# Altium project X_TRACK V3.1.PrjPcb
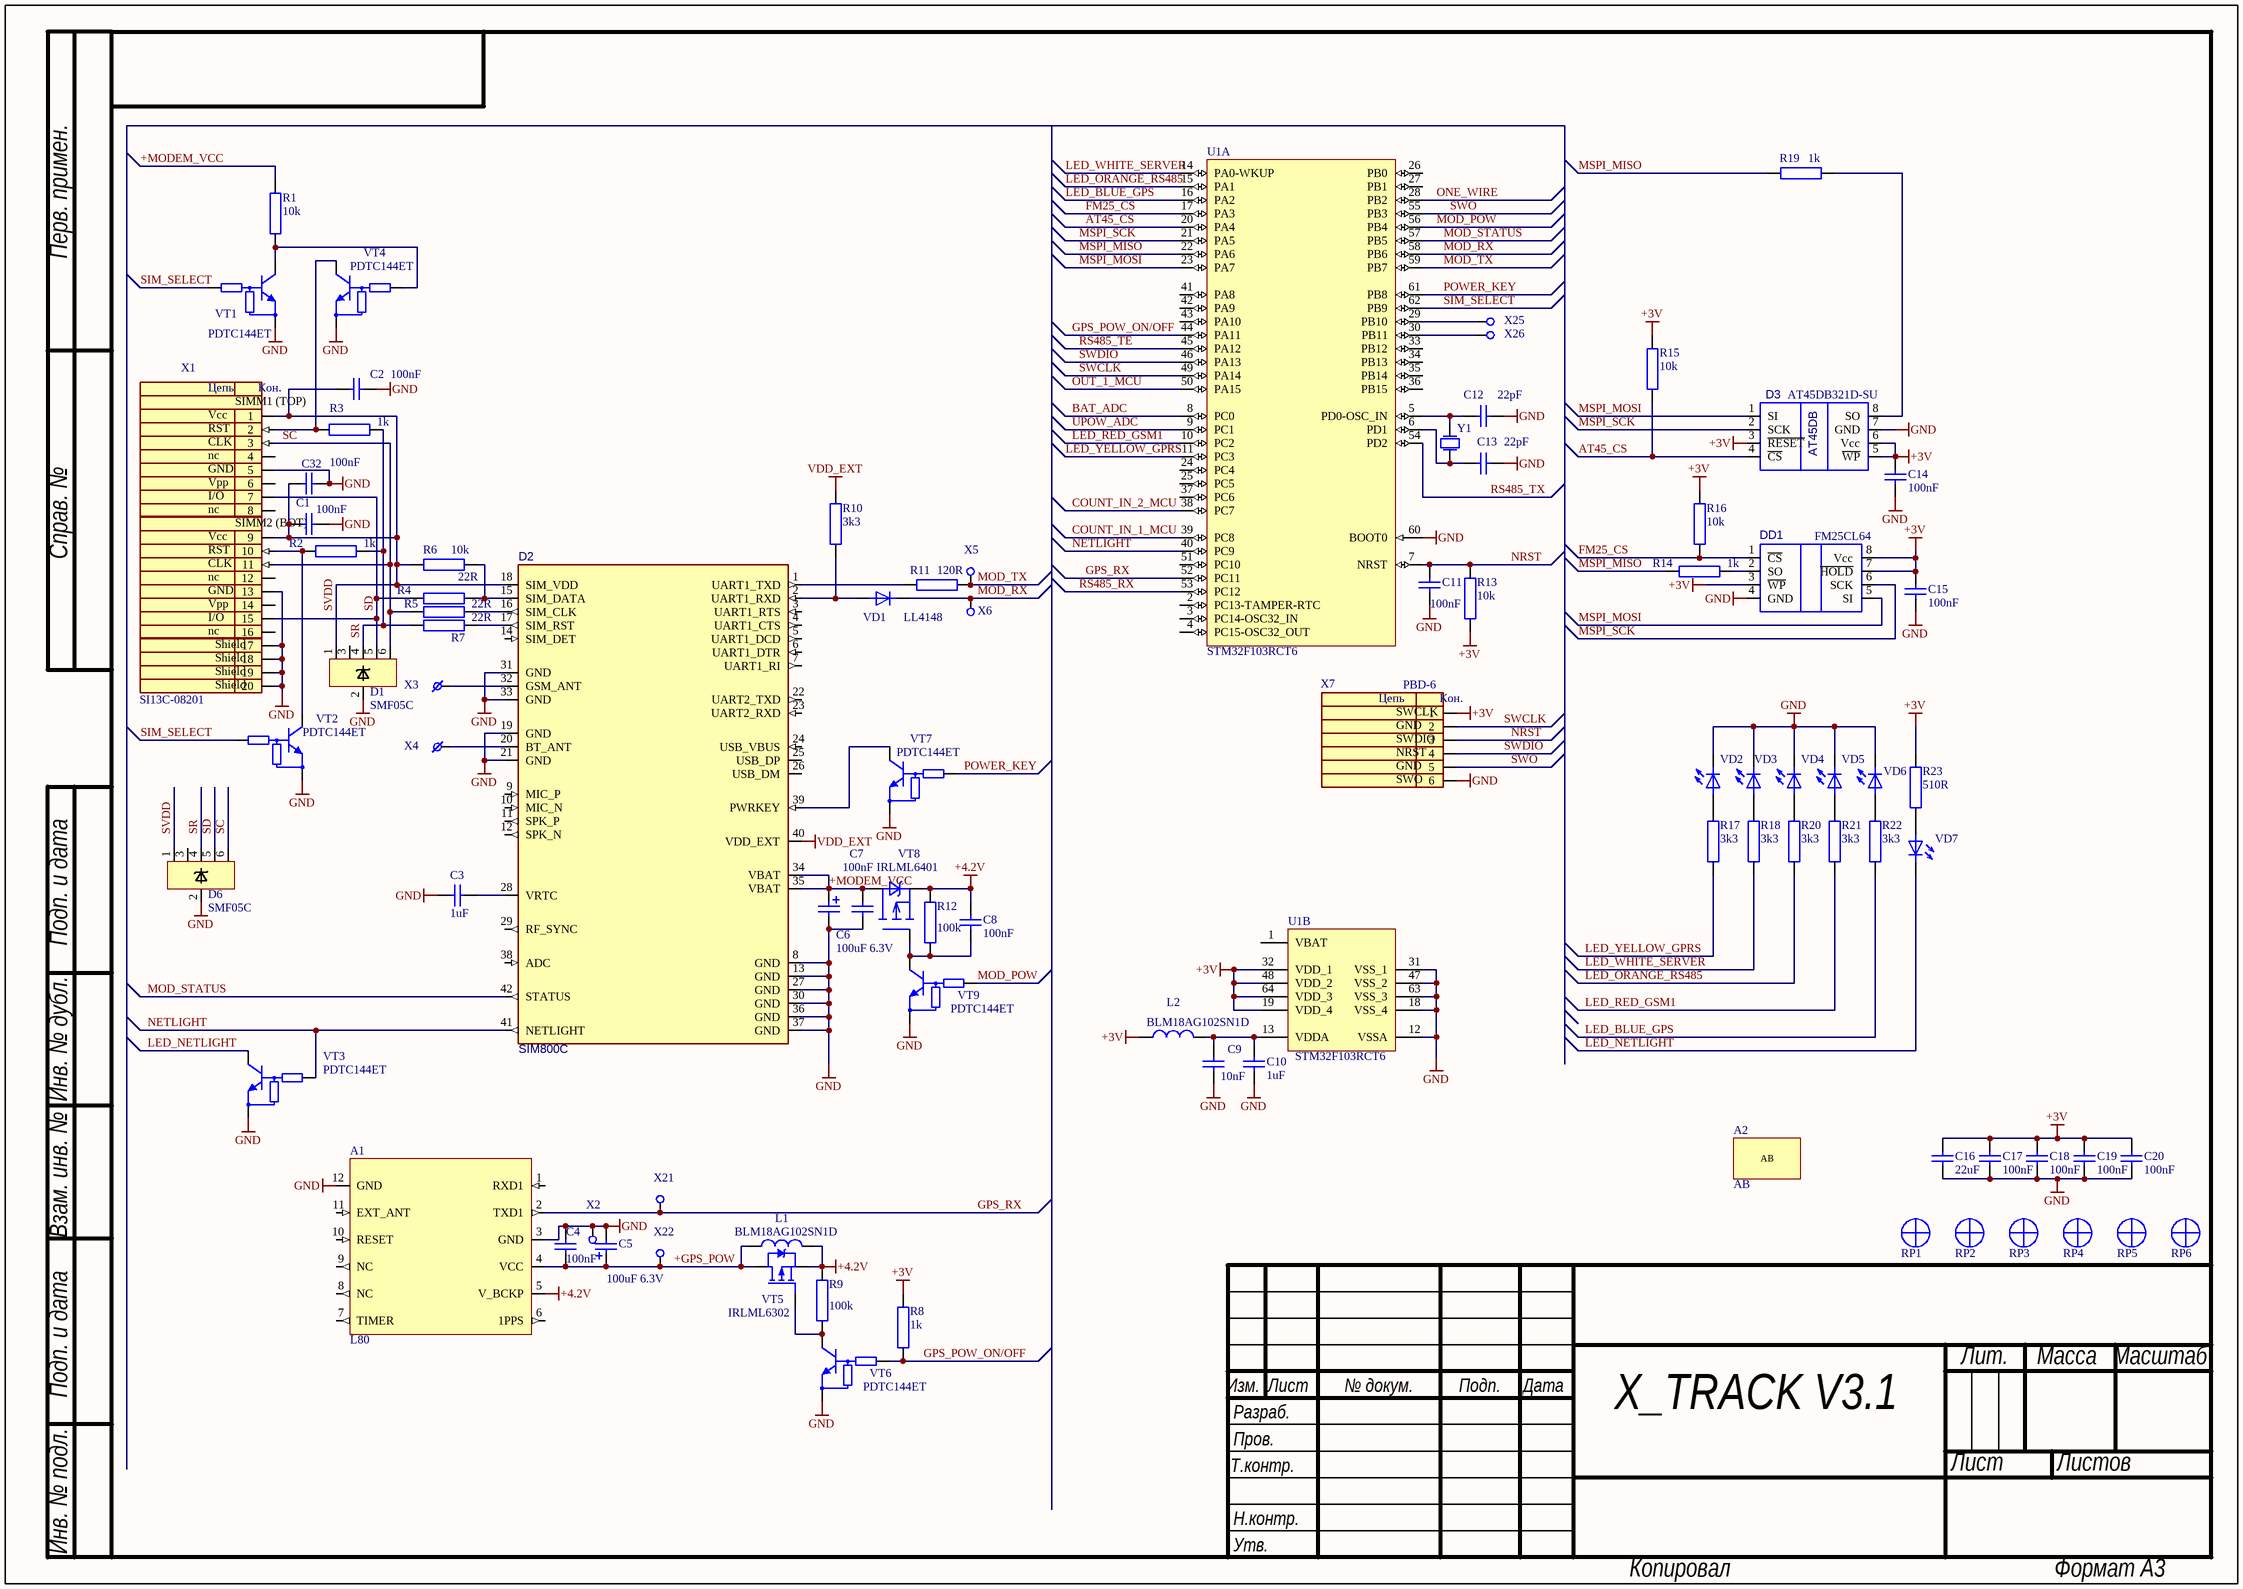
[diagram p0: X_TRACK_MCU V3.1.SchDoc]
2 sheets, 150 parts. Net scope: global (net labels, ports and power ports of the same name join across sheets).
Board file: X_TRACK V3.1.PcbDoc
Sheets:
  X_TRACK_MCU V3.1.SchDoc
  X_TRACK_PWR V3.1.SchDoc

## Sheet X_TRACK_MCU V3.1.SchDoc: X_TRACK V3.1
size 420 x 297 mm; PageSetup: Record=PageOptions|CenterHorizontal=False|CenterVertical=False|PrintScale=0.95|XCorrection=0.00|YCorrection=0.00|PrintKind=1|BorderSize=5000000|LeftOffset=0|BottomOffset=0|Orientation=1|PaperLength=1000|PaperWidth=1000|Scale=100|PaperSource=15|PrintQuality=600|MediaType=1|DitherType=10|PaperKind=A4|PrintScaleMode=1

### Parts
A1  L80  [L80]
A2  AB  [AB]
C1  value 100nF  [CC0805]  (hidden comment: CC0805_100nF)
C2  value 100nF  [CC0603]  (hidden comment: CC0603_100nF)
C3  value 1uF  [CC0603]  (hidden comment: CC0603_1uF)
C4  value 100nF  [CC0603]  (hidden comment: CC0603_100nF)
C5  value 100uF 6.3V  [6032_TC]  (hidden comment: C_TAJ 100uF 6.3V C)
C6  value 100uF 6.3V  [6032_TC]  (hidden comment: C_TAJ 100uF 6.3V C)
C7  value 100nF  [CC0603]  (hidden comment: CC0603_100nF)
C8  value 100nF  [CC0603]  (hidden comment: CC0603_100nF)
C9  value 10nF  [CC0603]  (hidden comment: CC0603_10nF)
C10  value 1uF  [CC0805]  (hidden comment: CC0805_1uF)
C11  value 100nF  [CC0603]  (hidden comment: CC0603_100nF)
C12  value 22pF  [CC0603]  (hidden comment: CC0603_22pF)
C13  value 22pF  [CC0603]  (hidden comment: CC0603_22pF)
C14  value 100nF  [CC0603]  (hidden comment: CC0603_100nF)
C15  value 100nF  [CC0603]  (hidden comment: CC0603_100nF)
C16  value 22uF  [CC0805]  (hidden comment: CC0805_10uF)
C17  value 100nF  [CC0603]  (hidden comment: CC0603_100nF)
C18  value 100nF  [CC0603]  (hidden comment: CC0603_100nF)
C19  value 100nF  [CC0603]  (hidden comment: CC0603_100nF)
C20  value 100nF  [CC0603]  (hidden comment: CC0603_100nF)
C32  value 100nF  [CC0603]  (hidden comment: CC0603_100nF)
D1  SMF05C  [sc70-6]
D2  SIM800C  [SIM800C]
D3  value AT45DB321D-SU  [8S2_N_2]  (hidden comment: AT45DB)
D6  SMF05C  [sc70-6]
DD1  FM25CL64  [SO8]
L1  value BLM18AG102SN1D  [BLM18]  (hidden comment: L_CIC10P601NC)
L2  value BLM18AG102SN1D  [BLM18]  (hidden comment: L_CIC10P601NC)
R1  value 10k  [RC0603]  (hidden comment: RC0603 10k)
R2  value 1k  [RC0603]  (hidden comment: RC0603 1k)
R3  value 1k  [RC0603]  (hidden comment: RC0603 1k)
R4  value 22R  [RC0603]  (hidden comment: RC0603 22R)
R5  value 22R  [RC0603]  (hidden comment: RC0603 22R)
R6  value 10k  [RC0603]  (hidden comment: RC0603 10k)
R7  value 22R  [RC0603]  (hidden comment: RC0603 22R)
R8  value 1k  [RC0603]  (hidden comment: RC0603 1k)
R9  value 100k  [RC0603]  (hidden comment: RC0603 100k)
R10  value 3k3  [RC0603]  (hidden comment: RC0603 10k)
R11  value 120R  [RC0603]  (hidden comment: RC0603 120R)
R12  value 100k  [RC0603]  (hidden comment: RC0603 100k)
R13  value 10k  [RC0603]  (hidden comment: RC0603 10k)
R14  value 1k  [RC0603]  (hidden comment: RC0603 1k)
R15  value 10k  [RC0603]  (hidden comment: RC0603 10k)
R16  value 10k  [RC0603]  (hidden comment: RC0603 10k)
R17  value 3k3  [RC0805]  (hidden comment: RC0805 1k)
R18  value 3k3  [RC0603]  (hidden comment: RC0603 300R)
R19  value 1k  [RC0603]  (hidden comment: RC0603 1k)
R20  value 3k3  [RC0603]  (hidden comment: RC0603 300R)
R21  value 3k3  [RC0603]  (hidden comment: RC0603 300R)
R22  value 3k3  [RC0603]  (hidden comment: RC0603 300R)
R23  value 510R  [RC0603]  (hidden comment: RC0603 300R)
RP1  Reper point  [REPER_1_2]  (value not drawn)
RP2  Reper point  [REPER_1_2]  (value not drawn)
RP3  Reper point  [REPER_1_2]  (value not drawn)
RP4  Reper point  [REPER_1_2]  (value not drawn)
RP5  Reper point  [REPER_1_2]  (value not drawn)
RP6  Reper point  [REPER_1_2]  (value not drawn)
U1  STM32F103RCT6  [LQFP64_N]  (parts A,B of 2)
VD1  value LL4148  [SOD80D_C]  (hidden comment: BAS85)
VD2  LED_KP-2012EC(0805)_1  [KP-2012EC]  (value not drawn)
VD3  LED_KP-2012EC(0805)_1  [KP-2012EC]  (value not drawn)
VD4  LED_KP-2012EC(0805)_1  [KP-2012EC]  (value not drawn)
VD5  LED_KP-2012EC(0805)_1  [KP-2012EC]  (value not drawn)
VD6  LED_KP-2012EC(0805)_1  [KP-2012EC]  (value not drawn)
VD7  LED_KP-2012EC(0805)_1  [KP-2012EC]  (value not drawn)
VT1  value PDTC144ET  [SOT23]  (hidden comment: PDTC123ET)
VT2  value PDTC144ET  [SOT23]  (hidden comment: PDTC123ET)
VT3  value PDTC144ET  [SOT23]  (hidden comment: PDTC123ET)
VT4  value PDTC144ET  [SOT23]  (hidden comment: PDTC123ET)
VT5  IRLML6302  [SOT23]
VT6  value PDTC144ET  [SOT23]  (hidden comment: PDTC123ET)
VT7  value PDTC144ET  [SOT23]  (hidden comment: PDTC123ET)
VT8  IRLML6401  [SOT23]
VT9  value PDTC144ET  [SOT23]  (hidden comment: PDTC123ET)
X1  SI13С-08201  [SI13C-08201]
X2  Con 1  [TP_0.8/1.5]  (value not drawn)
X3  Con_1  [TP_1.5/2.5]  (value not drawn)
X4  Con_1  [TP_1/2]  (value not drawn)
X5  Con 1  [TP_0.8/1.5]  (value not drawn)
X6  Con 1  [TP_0.8/1.5]  (value not drawn)
X7  value PBD-6  [PLS6]  (hidden comment: CON_1x6_)
X21  Con 1  [TP_0.8/1.5]  (value not drawn)
X22  Con 1  [TP_0.8/1.5]  (value not drawn)
X25  Con 1  [TP_0.5/1.0 - without silkscreen]  (value not drawn)
X26  Con 1  [TP_0.5/1.0 - without silkscreen]  (value not drawn)
Y1  XTAL  [CRYSTAL]  (value not drawn)

### Nets
+3V: C14.2 C15.2 C16.2 C17.2 C18.2 C19.2 C20.2 D3.3(~{RESET}) D3.5(~{WP}) D3.6(Vcc) DD1.3(~{WP}) DD1.7(~{HOLD}) DD1.8(Vcc) L2.1 R8.2 R13.2 R15.2 R16.2 R23.2 U1.19(VDD_4) U1.32(VDD_1) U1.48(VDD_2) U1.64(VDD_3) X7.1
+4.2V: A1.5(V_BCKP) C8.2 L1.2 R9.2 R12.2 VT5.2(S) VT8.2(S)
GND: A1.3(GND) A1.12(GND) C1.2 C2.2 C3.2 C4.1 C5.2 C6.2 C7.1 C9.1 C10.1 C11.1 C12.1 C13.1 C14.1 C15.1 C16.1 C17.1 C18.1 C19.1 C20.1 C32.1 D1.2(k) D2.8(GND) D2.13(GND) D2.19(GND) D2.21(GND) D2.27(GND) D2.30(GND) D2.31(GND) D2.33(GND) D2.36(GND) D2.37(GND) D3.7(GND) D6.2(k) DD1.4(GND) U1.12(VSSA) U1.18(VSS_4) U1.31(VSS_1) U1.47(VSS_2) U1.60(BOOT0) U1.63(VSS_3) VD2.2(K) VD3.2(K) VD4.2(K) VD5.2(K) VD6.2(K) VT1.2(E) VT2.2(E) VT3.2(E) VT4.2(E) VT6.2(E) VT7.2(E) VT9.2(E) X1.5 X1.13 X1.17 X1.18 X1.19 X1.20 X2.1 X7.6
VDD_EXT: D2.40(VDD_EXT) R10.2
+GPS_POW: A1.4(VCC) C4.2 C5.1 L1.1 VT5.3(D) X22.1
+MODEM_VCC: C6.1 C7.2 D2.34(VBAT) D2.35(VBAT) R1.1 VT8.3(D)
AT45_CS: D3.4(~{CS}) R15.1 U1.20(PA4)
BAT_ADC: U1.8(PC0)
COUNT_IN_1_MCU: U1.39(PC8)
COUNT_IN_2_MCU: U1.38(PC7)
FM25_CS: DD1.1(~{CS}) R16.1 U1.17(PA3)
GPS_POW_ON/OFF: R8.1 U1.44(PA11) VT6.1(B)
GPS_RX: A1.2(TXD1) U1.52(PC11) X21.1
LED_BLUE_GPS: R22.1 U1.16(PA2)
LED_NETLIGHT: VD7.2(K) VT3.3(C)
LED_ORANGE_RS485: R20.1 U1.15(PA1)
LED_RED_GSM1: R21.1 U1.10(PC2)
LED_WHITE_SERVER: R18.1 U1.14(PA0-WKUP)
LED_YELLOW_GPRS: R17.1 U1.11(PC3)
MOD_POW: U1.56(PB4) VT9.1(B)
MOD_RX: U1.58(PB6) VD1.2(K) X6.1
MOD_STATUS: D2.42(STATUS) U1.57(PB5)
MOD_TX: R11.1 U1.59(PB7) X5.1
MSPI_MISO: R14.1 R19.1 U1.22(PA6)
MSPI_MOSI: D3.1(SI) DD1.5(SI) U1.23(PA7)
MSPI_SCK: D3.2(SCK) DD1.6(SCK) U1.21(PA5)
NETLIGHT: D2.41(NETLIGHT) U1.40(PC9) VT3.1(B)
NRST: C11.2 R13.1 U1.7(NRST) X7.3
ONE_WIRE: U1.28(PB2)
OUT_1_MCU: U1.50(PA15)
POWER_KEY: U1.61(PB8) VT7.1(B)
RS485_RX: U1.53(PC12)
RS485_TE: U1.45(PA12)
RS485_TX: U1.54(PD2)
SC: D1.6(k) D6.6(k) R5.1 X1.3 X1.11
SD: D1.5(k) D6.5(k) R4.1 X1.7 X1.15
SIM_SELECT: U1.62(PB9) VT1.1(B) VT2.1(B)
SR: D1.4(k) D6.4(k) R2.2 R3.2 R7.1
SVDD: C1.1 C2.1 C32.2 D1.1(k) D2.18(SIM_VDD) D6.1(k) R6.1 X1.1 X1.9
SWCLK: U1.49(PA14) X7.2
SWDIO: U1.46(PA13) X7.4
SWO: U1.55(PB3) X7.5
UPOW_ADC: U1.9(PC1)
NetC3_1: C3.1 D2.28(VRTC)
NetC8_1: C8.1 R12.1 VT8.1(G) VT9.3(C)
NetC9_2: C9.2 C10.2 L2.2 U1.13(VDDA)
NetC12_2: C12.2 U1.5(PD0-OSC_IN) Y1.2(OSC2)
NetC13_2: C13.2 U1.6(PD1) Y1.1(OSC1)
NetD2_1: D2.1(UART1_TXD) R11.2
NetD2_2: D2.2(UART1_RXD) R10.1 VD1.1(A)
NetD2_15: D2.15(SIM_DATA) R4.2 R6.2
NetD2_16: D2.16(SIM_CLK) R5.2
NetD2_17: D2.17(SIM_RST) R7.2
NetD2_20: D2.20(BT_ANT) X4.1
NetD2_32: D2.32(GSM_ANT) X3.1
NetD2_39: D2.39(PWRKEY) VT7.3(C)
NetD3_8: D3.8(SO) R19.2
NetDD1_2: DD1.2(SO) R14.2
NetR1_2: R1.2 VT1.3(C) VT4.1(B)
NetR2_1: R2.1 VT2.3(C) X1.10
NetR3_1: R3.1 VT4.3(C) X1.2
NetR9_1: R9.1 VT5.1(G) VT6.3(C)
NetR17_2: R17.2 VD2.1(A)
NetR18_2: R18.2 VD3.1(A)
NetR20_2: R20.2 VD4.1(A)
NetR21_2: R21.2 VD5.1(A)
NetR22_2: R22.2 VD6.1(A)
NetR23_1: R23.1 VD7.1(A)
NetU1_29: U1.29(PB10) X25.1
NetU1_30: U1.30(PB11) X26.1

Not connected (* = marked no-connect by the designer): A1 1(RXD1) 6(1PPS) 7(TIMER) 8(NC) 9(NC) 10(RESET) 11(EXT_ANT); D1 3(k); D2 3(UART1_RTS) 4(UART1_CTS) 5(UART1_DCD) 6(UART1_DTR) 7(UART1_RI) 9(MIC_P) 10(MIC_N) 11(SPK_P) 12(SPK_N) 14(SIM_DET) 22(UART2_TXD) 23(UART2_RXD) 24(USB_VBUS) 25(USB_DP) 26(USB_DM) 29(RF_SYNC) 38(ADC); D6 3(k); U1 1(VBAT) 2(PC13-TAMPER-RTC) 3(PC14-OSC32_IN) 4(PC15-OSC32_OUT) 24(PC4) 25(PC5) 26(PB0) 27(PB1) 33(PB12) 34(PB13) 35(PB14) 36(PB15) 37(PC6) 41(PA8) 42(PA9) 43(PA10) 51(PC10); X1 4 6 8 12 14 16

### Notes on the sheet
- Перв. примен.
- Справ. №
- Подп. и дата
- Инв. № дубл.
- Взам. инв. №
- Изм.
- Лист
- № докум.
- Подп.
- Дата
- Лит.
- Масса
- Масштаб
- Т.контр.
- Пров.
- Разраб.
- Листов
- Инв. № подл.
- Н.контр.
- Утв.
- Копировал
- Формат А3
- (in symbol CON_1x6_) Цепь; Кон.; SWCLK; GND; SWDIO; NRST; SWO
- (in symbol SI13С-08201) Цепь; Кон.; SIMM1 (TOP); Vcc; RST; CLK; nc; GND; Vpp; I/O; SIMM2 (BOT); Shield

### Library data of the parts
A1 = L80: Quectel  Slim GPS Module  Integrated Patch Antenna; Package: LCC12; Manufacturer: Quectel; Value: L80
C1 = CC0805_100nF: Capacitor SMD 0805 X7R 100nF 20% 50V; Manufacturer: Hitano; Manufacturer p/n: 0805B104M500N2; Package: 0805
C2 C4 C7 C8 C11 C14 C15 C17-C20 C32 = CC0603_100nF: Capacitor SMD 0603 X7R 100nF 20% 50V; Manufacturer: Hitano; Manufacturer p/n: 0603B104M500N3; Package: 0603
C3 = CC0603_1uF: Capacitor SMD 0603 X7R 1uF 20% 10V; Manufacturer: Hitano; Manufacturer p/n: 0603B105M100N3; Package: 0603
C5 C6 = C_TAJ 100uF 6.3V C: Capacitor tantall; Manufacturer: AVX; Manufacturer p/n: TAJC107M006RNJ; Package: case C
C9 = CC0603_10nF: Capacitor SMD 0603 X7R 10nF 20% 50V; Manufacturer: Hitano; Manufacturer p/n: 0603B103M500N3; Package: 0603
C10 = CC0805_1uF: Capacitor SMD 0805 Y5V 1uF 20% 16V; Manufacturer: Hitano; Manufacturer p/n: 0805Y105M160N3; Package: 0805
C12 C13 = CC0603_22pF: Capacitor SMD 0603 NPO 22pF 5% 50V; Manufacturer: Hitano; Manufacturer p/n: 0603N220J500NT; Package: 0603
C16 = CC0805_10uF: Capacitor SMD 0805 Y5V 10uF 20% 16V; Manufacturer: Hitano; Manufacturer p/n: 0805Y106Z160N3; Package: 0805
D1 D6 = SMF05C: TVS Diode Array For ESD and Latch-Up Protection; Manufacturer: Semtech; Package: SC70-6L; Value: SMF05C
D2 = SIM800C: Manufacturer: SIMCOM; Package: LLC-42; Value: SIM800C
L1 L2 = L_CIC10P601NC: SMD inductance 750mA; Manufacturer: Samsung; Package: L0603
R1 R6 R10 R13 R15 R16 = RC0603 10k: Resistor  SMD RC0603 5% 10k; Manufacturer: Hitano; Manufacturer p/n: Hitano RC0603JR7-10k; Package: RC0603
R2 R3 R8 R14 R19 = RC0603 1k: Resistor  SMD 0603  5% 1k; Manufacturer: Hitano; Manufacturer p/n: Hitano RC0603JR7-1k; Package: RC0603
R4 R5 R7 = RC0603 22R: Resistor  SMD 0603 5% 22R; Manufacturer: Hitano; Manufacturer p/n: Hitano RC0603JR7-22R; Package: RC0603
R9 R12 = RC0603 100k: Resistor  SMD 0603 5% 100k; Manufacturer: Hitano; Manufacturer p/n: Hitano RC0603JR7-100k; Package: RC0603
R11 = RC0603 120R: Resistor  SMD 0603 5% 120R; Manufacturer: Hitano; Manufacturer p/n: Hitano RC0603JR7-120R; Package: RC0603
R17 = RC0805 1k: Resistor  SMD 0805 5% 1k; Manufacturer: Hitano; Manufacturer p/n: Hitano RC0805JR7-1k; Package: RC0805
R18 R20-R23 = RC0603 300R: Resistor  SMD 0603 5% 300R; Manufacturer: Hitano; Manufacturer p/n: Hitano RC0603JR7-300R; Package: RC0603
RP1-RP6 = Reper point: Reper point 1_2 mm
U1 = STM32F103RCT6: STM32 ARM-based 32-bit MCU Performance Line with 256 kB Flash, 48 kB Internal RAM, -40 to +85°C Temperature, 64-Pin LQFP, Tray; DatasheetVersion: rev8.0, Apr-2011; PackageVersion: rev13, Apr-2011; PackageReference: LQFP64; PackageDescription: 64-Pin Low-Profile Quad Flat Pack, 10 x 10 mm Body, 0.5 mm Pitch (LQFP64); ComponentLink1Description: Manufacturer URL; ComponentLink1URL: http://www.st.com/; ComponentLink2Description: STM32F103 Datasheet; ComponentLink2URL: http://www.st.com/internet/com/TECHNICAL_RESOURCES/TECHNICAL_LITERATURE/DATASHEET/CD00191185.pdf; ComponentLink3Description: STM32 Family Web Page; ComponentLink3URL: www.st.com/stm32
VD1 = BAS85: SMD Diod BAS85; Manufacturer: Philips/NXP; Package: SOD80
VD2-VD7 = LED_KP-2012EC(0805)_1: 2.0mmx1.25mm SMT LED,1.1mm thickness High Efficiency Red; Manufacturer: Kingbright; Package: SMD-0805; Value: KP-2012EC
VT1-VT4 VT6 VT7 VT9 = PDTC123ET: NPN Digital transistor with bult-in resistor 2k  100mA/50V; Manufacturer: NXP Semiconductors; Published: 8-Jun-2000; LatestRevisionDate: 17-Jul-2002; LatestRevisionNote: Re-released for DXP Platform.; PackageReference: SOT-23B; Publisher: Altium Limited; Code_JEDEC: SOT-23; Package: SOT23-3
VT5 = IRLML6302: P-Channel Power MOSFET 20V 0.78A(25`C); Manufacturer: International Rectifier; Package: SOT23-3; Value: IRLML6302
VT8 = IRLML6401: RefDes2: {RefDes2}; Value: IRLML6401
X1 = SI13С-08201: Dual SIM Card Connector h=3.0mm max; Manufacturer: ATOM; Package: SMT; Value: SI13С-08201
X2 X5 X6 X21 X22 X25 X26 = Con 1: Contact; Value: TP_SMD
X3 X4 = Con_1: Contact; Value: TP_SMD
X7 = CON_1x6_: CON_1x6; Manufacturer: Amtek; Package: Dip
Y1 = XTAL: Crystal Oscillator; Manufacturer: Jauch; Value_3: Q 14.7456-SS4-30-30/50; Value_2: Q 0.03276-MTF32-12.5-20; Value: Q 14.7456-SMU3-30-30/50; Package: SMU3
DD1 = FM25CL64: Value: FM25CL64

## Sheet X_TRACK_PWR V3.1.SchDoc
size 420 x 297 mm; PageSetup: Record=PageOptions|CenterHorizontal=False|CenterVertical=False|PrintScale=0.67|XCorrection=0.00|YCorrection=0.00|PrintKind=2|BorderSize=5000000|LeftOffset=0|BottomOffset=0|Orientation=2|PaperLength=2969|PaperWidth=2100|Scale=100|PaperSource=7|PrintQuality=600|MediaType=1|DitherType=10|PaperKind=A4 (210 x 297 мм)|PrintScaleMode=1
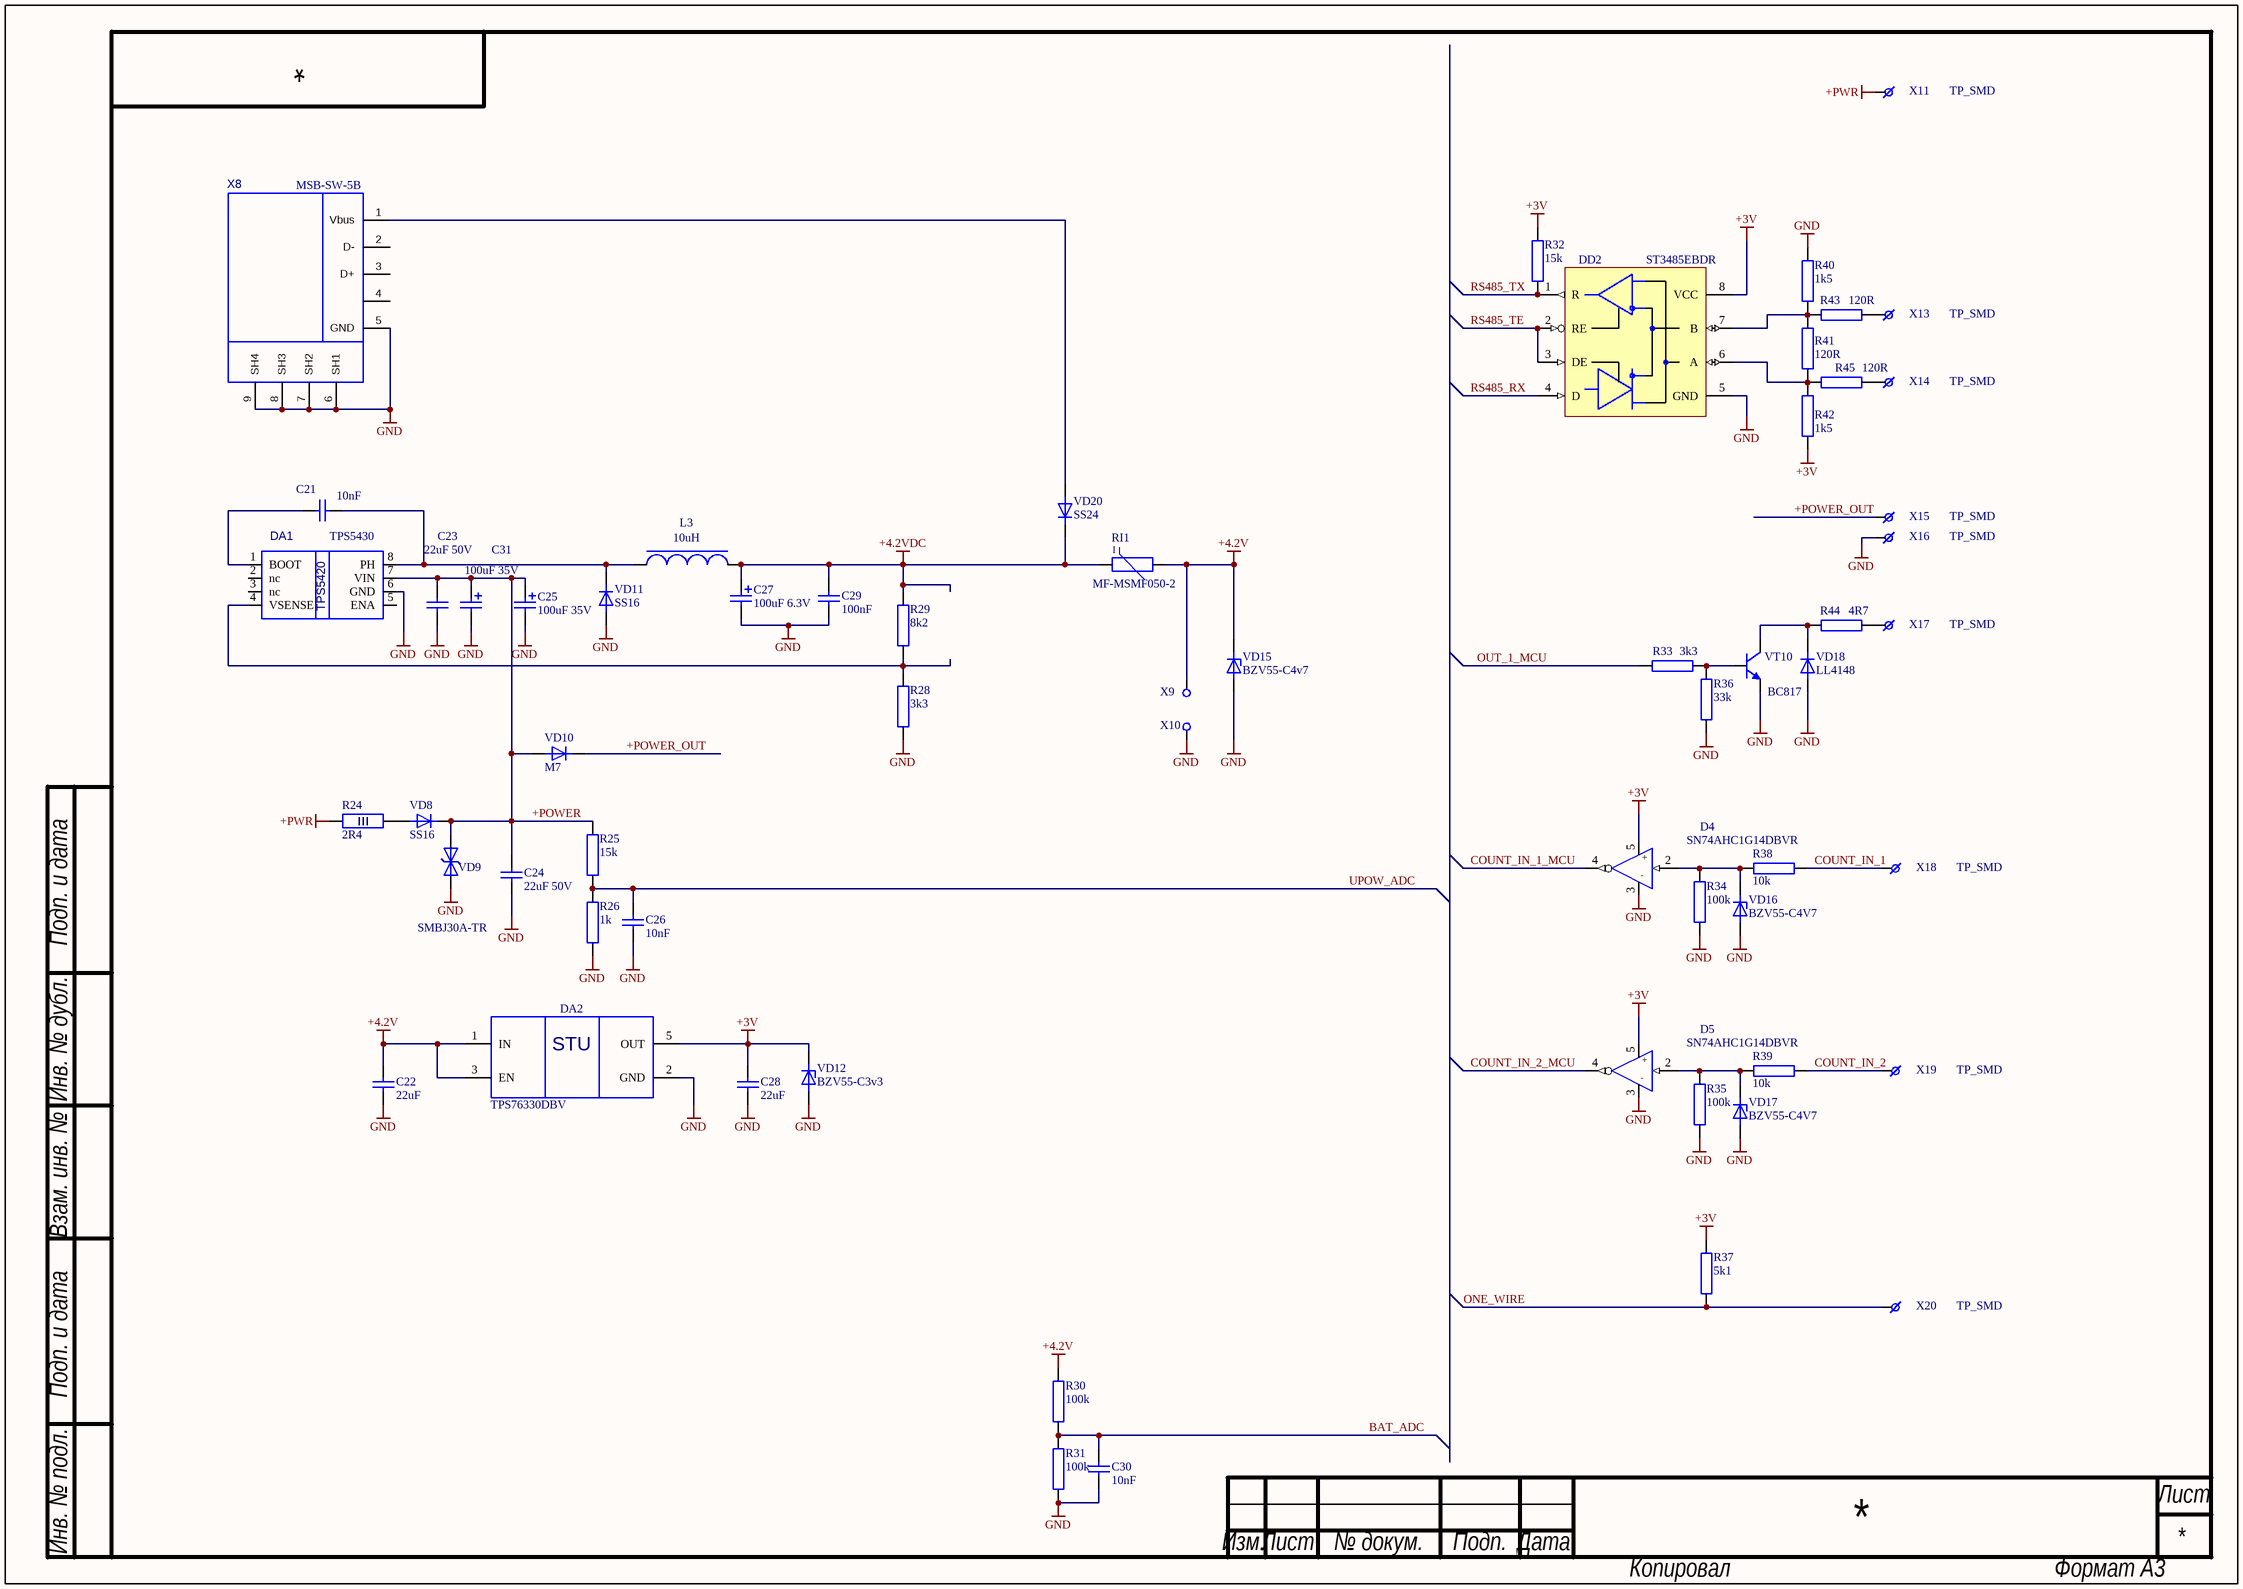
[diagram p1: X_TRACK_PWR V3.1.SchDoc]

### Parts
C21  value 10nF  [CC0603]  (hidden comment: CC0603_10nF)
C22  value 22uF  [CC0805]  (hidden comment: CC0805_10uF)
C23  value 22uF 50V  [CC1206]  (hidden comment: CC1206_10uF)
C24  value 22uF 50V  [CC1206]  (hidden comment: CC1206_10uF)
C25  value 100uF 35V  [CAPPR2.5-6.3X11.5 - HR]  (hidden comment: C_ECR_100uF 35V_(D6))
C26  value 10nF  [CC0603]  (hidden comment: CC0603_10nF)
C27  value 100uF 6.3V  [6032_TC]  (hidden comment: C_TAJ 100uF 6.3V C)
C28  value 22uF  [CC0805]  (hidden comment: CC0805_10uF)
C29  value 100nF  [CC0603]  (hidden comment: CC0603_100nF)
C30  value 10nF  [CC0603]  (hidden comment: CC0603_10nF)
C31  value 100uF 35V  [CAPPR2.5-6.3X11.5 - HL]  (hidden comment: C_ECR_100uF 35V_(D6))
D4  SN74AHC1G14DBVR  [SOT23-5AN]
D5  SN74AHC1G14DBVR  [SOT23-5AN]
DA1  value TPS5430  [SO8]  (hidden comment: TPS5420)
DA2  TPS76330DBV  [SOT23-5]
DD2  value ST3485EBDR  [8S1_L]  (hidden comment: SN75176)
L3  value 10uH  [CDRH6D38]  (hidden comment: CDRH6D38)
R24  value 2R4  [MFR300- 3W-23-17.5X6.5]  (hidden comment: R_MFR03W)
R25  value 15k  [RC0603]  (hidden comment: RC0603 15k)
R26  value 1k  [RC0603]  (hidden comment: RC0603 1k)
R28  value 3k3  [RC0603]  (hidden comment: RC0603 3k3)
R29  value 8k2  [RC0603]  (hidden comment: RC0603 8k2)
R30  value 100k  [RC0603]  (hidden comment: RC0603 100k)
R31  value 100k  [RC0603]  (hidden comment: RC0603 100k)
R32  value 15k  [RC0603]  (hidden comment: RC0603 15k)
R33  value 3k3  [RC0603]  (hidden comment: RC0603 3k3)
R34  value 100k  [RC0603]  (hidden comment: RC0603 100k)
R35  value 100k  [RC0603]  (hidden comment: RC0603 100k)
R36  value 33k  [RC0603]  (hidden comment: RC0603 33k)
R37  value 5k1  [RC0603]  (hidden comment: RC0603 5k1)
R38  value 10k  [RC0603]  (hidden comment: RC0603 4k7)
R39  value 10k  [RC0603]  (hidden comment: RC0603 4k7)
R40  value 1k5  [RC0603]  (hidden comment: RC0603 1k5)
R41  value 120R  [RC0603]  (hidden comment: RC0603 120R)
R42  value 1k5  [RC0603]  (hidden comment: RC0603 1k5)
R43  value 120R  [RC0603]  (hidden comment: RC0603 120R)
R44  value 4R7  [RC0603]  (hidden comment: RC0603 10R)
R45  value 120R  [RC0603]  (hidden comment: RC0603 120R)
RI1  value MF-MSMF050-2  [FSMD1812 Series]  (hidden comment: POLY_PTS)
VD8  value SS16  [SMA/DO-214AC]  (hidden comment: M7)
VD9  value SMBJ30A-TR  [SMB/DO-214AA]  (hidden comment: Suppressor)
VD10  M7  [SMA/DO-214AC]
VD11  value SS16  [SMB/DO-214AA]  (hidden comment: SS24)
VD12  value BZV55-C3v3  [SOD80D_C]  (hidden comment: Zener)
VD15  value BZV55-C4v7  [SOD80D_C]  (hidden comment: Zener)
VD16  value BZV55-C4V7  [SOD80D_C]  (hidden comment: Zener)
VD17  value BZV55-C4V7  [SOD80D_C]  (hidden comment: Zener)
VD18  LL4148  [SOD80D_C]
VD20  SS24  [SMB/DO-214AA]
VT10  BC817  [SOT23]
X8  MSB-SW-5B  [MSB-SW-5B]
X9  Con 1  [TP_1/2]  (value not drawn)
X10  Con 1  [TP_1/2]  (value not drawn)
X11  value TP_SMD  [TP_1.5/2.5]  (hidden comment: Con_1)
X13  value TP_SMD  [TP_1/2]  (hidden comment: Con_1)
X14  value TP_SMD  [TP_1/2]  (hidden comment: Con_1)
X15  value TP_SMD  [TP_1/2]  (hidden comment: Con_1)
X16  value TP_SMD  [TP_1/2]  (hidden comment: Con_1)
X17  value TP_SMD  [TP_1/2]  (hidden comment: Con_1)
X18  value TP_SMD  [TP_1/2]  (hidden comment: Con_1)
X19  value TP_SMD  [TP_1/2]  (hidden comment: Con_1)
X20  value TP_SMD  [TP_1/2]  (hidden comment: Con_1)

### Nets
+3V: C28.2 D4.5(+V) D5.5(+V) DA2.5(OUT) DD2.8(VCC) R32.2 R37.2 R42.1 VD12.2(K)
+4.2V: C22.2 DA2.1(IN) DA2.3(EN) R30.2 RI1.1 VD15.2(K) X9.1
+4.2VDC: C27.1 C29.1 L3.2 R29.2 RI1.2 VD20.2(K)
+PWR: R24.1 X11.1
GND: C22.1 C23.1 C24.1 C25.2 C26.1 C27.2 C28.1 C29.2 C30.1 C31.2 D4.3(GND) D5.3(GND) DA1.6(GND) DA2.2(GND) DD2.5(GND) R26.1 R28.1 R31.1 R34.1 R35.1 R36.1 R40.2 VD9.1(A) VD11.1(A) VD12.1(A) VD15.1(A) VD16.1(A) VD17.1(A) VD18.1(A) VT10.2(E) X8.5(GND) X8.6(SH1) X8.7(SH2) X8.8(SH3) X8.9(SH4) X10.1 X16.1
+POWER: C23.2 C24.2 C25.1 C31.1 DA1.7(VIN) R25.2 VD8.2(K) VD9.2(K) VD10.1(A)
+POWER_OUT: VD10.2(K) X15.1
BAT_ADC: C30.2 R30.1 R31.2
COUNT_IN_1: R38.1 X18.1
COUNT_IN_1_MCU: D4.4(Y)
COUNT_IN_2: R39.1 X19.1
COUNT_IN_2_MCU: D5.4(Y)
ONE_WIRE: R37.1 X20.1
OUT_1_MCU: R33.1
RS485_RX: DD2.4(D)
RS485_TE: DD2.2(RE) DD2.3(DE)
RS485_TX: DD2.1(R) R32.1
UPOW_ADC: C26.2 R25.1 R26.2
NetC21_1: C21.1 DA1.1(BOOT)
NetC21_2: C21.2 DA1.8(PH) L3.1 VD11.2(K)
NetD4_2: D4.2(A) R34.2 R38.2 VD16.2(K)
NetD5_2: D5.2(A) R35.2 R39.2 VD17.2(K)
NetDA1_4: DA1.4(VSENSE) R28.2 R29.1
NetDD2_6: DD2.6(A) R41.1 R42.2 R45.2
NetDD2_7: DD2.7(B) R40.1 R41.2 R43.2
NetR24_2: R24.2 VD8.1(A)
NetR33_2: R33.2 R36.2 VT10.1(B)
NetR43_1: R43.1 X13.1
NetR44_1: R44.1 X17.1
NetR44_2: R44.2 VD18.2(K) VT10.3(C)
NetR45_1: R45.1 X14.1
NetVD20_1: VD20.1(A) X8.1(Vbus)

Not connected (* = marked no-connect by the designer): DA1 2(nc) 3(nc) 5(ENA); DA2 4; X8 2(D-) 3(D+) 4

### Notes on the sheet
- Подп. и дата
- Инв. № дубл.
- Взам. инв. №
- Инв. № подл.
- Лист
- Изм.
- № докум.
- Подп.
- Дата
- Копировал
- Формат А3
- (in symbol FSMD110-16) I
- (in symbol SN74AHC1G14DBVR) +; -
- (in symbol TPS76330DBV) STU

### Library data of the parts
C21 C26 C30 = CC0603_10nF: as C9 on sheet X_TRACK_MCU V3.1; Package: 0603
C22 C28 = CC0805_10uF: as C16 on sheet X_TRACK_MCU V3.1; Package: 0805
C23 C24 = CC1206_10uF: Capacitor SMD 1206 X5R 10uF 20% 50V; Manufacturer: Hitano; Manufacturer p/n: 1206X106M500NT; Package: 1206
C25 C31 = C_ECR_100uF 35V_(D6): Standard Capacitor polarized Radial leads, cylindrical aluminum case,; Manufacturer: Hitano; Manufacturer p/n: ECR101M35BA; Package: 2.5x6x11(PinSpac.*Dia*H)
C27 = C_TAJ 100uF 6.3V C: as C5 on sheet X_TRACK_MCU V3.1; Package: case C
C29 = CC0603_100nF: as C2 on sheet X_TRACK_MCU V3.1; Package: 0603
D4 D5 = SN74AHC1G14DBVR: SINGLE  SCHMITT-TRIGGER  INVERTER  GATE; Manufacturer: Texas  Instruments; Package: SOT23-5; Value: SN74AHC1G14DBVR
DA2 = TPS76330DBV: RefDes2: {RefDes2}; Value: TPS76330DBV
DD2 = SN75176: DRIVER RS-422/DIFFERENTIAL DRIVER AND RECEIVER PAIR
R24 = R_MFR03W: Resistor  axial 3W; Manufacturer: Uni-ohm; Package: 3W
R25 R32 = RC0603 15k: Resistor  SMD RC0603 5% 15k; Manufacturer: Hitano; Manufacturer p/n: Hitano RC0603JR7-15k; Package: RC0603
R26 = RC0603 1k: as R2 on sheet X_TRACK_MCU V3.1; Package: RC0603
R28 R33 = RC0603 3k3: Resistor  SMD 0603  5% 3k3; Manufacturer: Hitano; Manufacturer p/n: Hitano RC0603JR7-3k3; Package: RC0603
R29 = RC0603 8k2: Resistor  SMD 0603  5% 8k2; Manufacturer: Hitano; Manufacturer p/n: Hitano RC0603JR7- 8k2; Package: RC0603
R30 R31 R34 R35 = RC0603 100k: as R9 on sheet X_TRACK_MCU V3.1; Package: RC0603
R36 = RC0603 33k: Resistor  SMD 0603 5% 33k; Manufacturer: Hitano; Manufacturer p/n: Hitano RC0603JR7-33k; Package: RC0603
R37 = RC0603 5k1: Resistor  SMD 0603 5% 5k1; Manufacturer: Hitano; Manufacturer p/n: Hitano RC0603JR7-5k1; Package: RC0603
R38 R39 = RC0603 4k7: Resistor  SMD 0603 5% 4k7; Manufacturer: Hitano; Manufacturer p/n: Hitano RC0603JR7-4k7; Package: RC0603
R40 R42 = RC0603 1k5: Resistor  SMD 0603  5% 1k5; Manufacturer: Hitano; Manufacturer p/n: Hitano RC0603JR7-1k5; Package: RC0603
R41 R43 R45 = RC0603 120R: as R11 on sheet X_TRACK_MCU V3.1; Package: RC0603
R44 = RC0603 10R: Resistor  SMD 0603 5% 10R; Manufacturer: Hitano; Manufacturer p/n: Hitano RC0603JR7-10R; Package: RC0603
RI1 = FSMD110-16: Polymeric PTC resettable fuses; Manufacturer: Fuzetech; Package: 1812
VD8 VD10 = M7: SURFACE MOUNT GENERAL RECTIFIER; Manufacturer: Suntan Technology Company Limited; Package: DO-214AC(SMA)
  VD10: Value: M7
VD9 = Suppressor: TRANSIENT VOLTAGE SUPPRESSORS
VD11 VD20 = SS24: SMD Diod 2A 40V; Manufacturer: Vishay Semiconductors; Package: DO-214AA (SMB)
  VD20: Value: SS24
VD12 VD15-VD17 = Zener: Zener diode; Manufacturer: Philips; Package: SOD80
VD18 = LL4148: SMD Diod LL4148; Manufacturer: Fairchild Semiconductor; Package: SOD80; Value: LL4148
VT10 = BC817: NPN general-purpose transistors, 45V, 500mA; Manufacturer: Philips; Manufacturer p/n: BC817; Package: SOT23-3; Value: BC817
X9 X10 = Con 1: Contact; Value: TP_SMD
X11 X13-X20 = Con_1: Contact
X8 = MSB-SW-5B: Value: MSB-SW-5B

## Nets that join several sheets
+3V: X_TRACK_MCU V3.1 (24 pins), X_TRACK_PWR V3.1 (9 pins)
+4.2V: X_TRACK_MCU V3.1 (7 pins), X_TRACK_PWR V3.1 (7 pins)
GND: X_TRACK_MCU V3.1 (62 pins), X_TRACK_PWR V3.1 (37 pins)
BAT_ADC: X_TRACK_MCU V3.1 (U1.8), X_TRACK_PWR V3.1 (C30.2 R30.1 R31.2)
COUNT_IN_1_MCU: X_TRACK_MCU V3.1 (U1.39), X_TRACK_PWR V3.1 (D4.4)
COUNT_IN_2_MCU: X_TRACK_MCU V3.1 (U1.38), X_TRACK_PWR V3.1 (D5.4)
ONE_WIRE: X_TRACK_MCU V3.1 (U1.28), X_TRACK_PWR V3.1 (R37.1 X20.1)
OUT_1_MCU: X_TRACK_MCU V3.1 (U1.50), X_TRACK_PWR V3.1 (R33.1)
RS485_RX: X_TRACK_MCU V3.1 (U1.53), X_TRACK_PWR V3.1 (DD2.4)
RS485_TE: X_TRACK_MCU V3.1 (U1.45), X_TRACK_PWR V3.1 (DD2.2 DD2.3)
RS485_TX: X_TRACK_MCU V3.1 (U1.54), X_TRACK_PWR V3.1 (DD2.1 R32.1)
UPOW_ADC: X_TRACK_MCU V3.1 (U1.9), X_TRACK_PWR V3.1 (C26.2 R25.1 R26.2)